# EAGLE schematic CoSchematic (EAGLE 7.5.0)
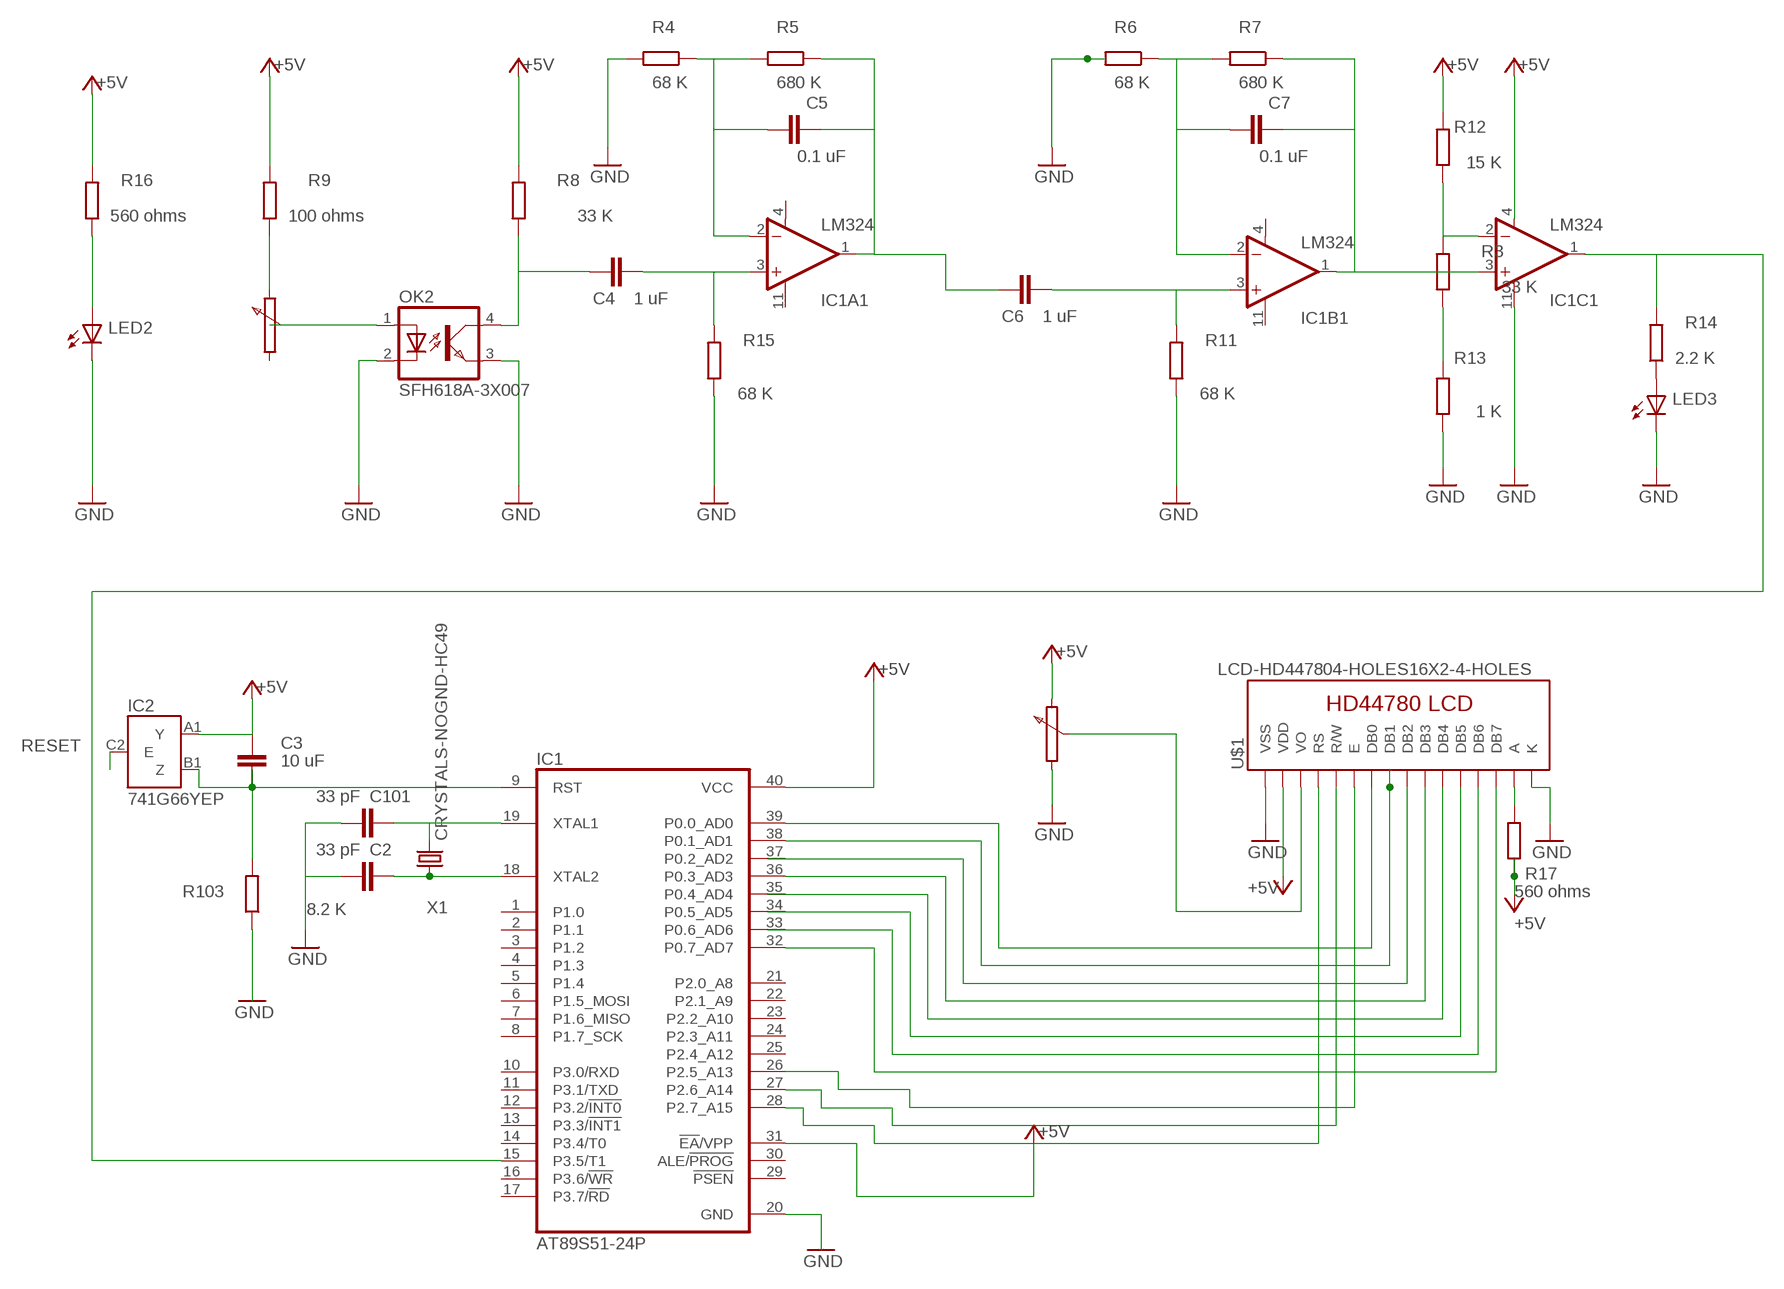
[diagram p0: schematic, sheet 1]

## Parts
C2  33 pF  C-EU050-030X075  [C050-030X075]
C3  10 uF  C-EU050-030X075  [C050-030X075]
C4  1 uF  C-EU050-030X075  [C050-030X075]
C5  0.1 uF  C-EU050-030X075  [C050-030X075]
C6  1 uF  C-EU050-030X075  [C050-030X075]
C7  0.1 uF  C-EU050-030X075  [C050-030X075]
C101  33 pF  C-EU050-030X075  [C050-030X075]
IC1  AT89S51-24P  [DIL40]
IC1A  LM324  [SOIC-14]
IC1B  LM324  [SOIC-14]
IC1C  LM324  [SOIC-14]
IC2  741G66YEP  [YEP_R-XBGA-N5]
LED2  LZ1-00WW03  [LZ1-00WW03]
LED3  LZ1-00WW03  [LZ1-00WW03]
OK2  SFH618A-3X007  [SMD4-7]
R3  33 K  R-EU_0207/10  [0207/10]
R4  68 K  R-EU_0207/10  [0207/10]
R5  680 K  R-EU_0207/10  [0207/10]
R6  68 K  R-EU_0207/10  [0207/10]
R7  680 K  R-EU_0207/10  [0207/10]
R8  33 K  R-EU_0207/10  [0207/10]
R9  100 ohms  R-EU_0207/10  [0207/10]
R11  68 K  R-EU_0207/10  [0207/10]
R12  15 K  R-EU_0207/10  [0207/10]
R13  1 K  R-EU_0207/10  [0207/10]
R14  2.2 K  R-EU_0207/10  [0207/10]
R15  68 K  R-EU_0207/10  [0207/10]
R16  560 ohms  R-EU_0207/10  [0207/10]
R17  560 ohms  R-EU_0207/10  [0207/10]
R103  8.2 K  R-EU_0207/10  [0207/10]
U$1  LCD-HD447804-HOLES16X2-4-HOLES  [LCD-16X2-4HOLES]
X1  CRYSTALS-NOGND-HC49  [HC49]

## Nets
+5V: C3.2 IC1.31(!EA!/VPP) IC1.40(VCC) R8.2 R9.2 R12.2 R16.2 R17.1 U$1.2(VDD)
GND: C2.2 C101.2 IC1C.11(1:V-) LED2.1(C) LED2.4(C) LED3.1(C) LED3.4(C) OK2.2(C) OK2.3(EMIT) R4.2 R6.2 R11.1 R13.1 R15.1 U$1.1(VSS) U$1.16(K)
N$1: C3.1 IC1.9(RST) IC2.B1(Z) R103.2
N$2: R103.1
N$4: C101.1 IC1.19(XTAL1) X1.2
N$5: U$1.3(VO)
N$6: C2.1 IC1.18(XTAL2) X1.1
N$7: IC1.28(P2.7_A15) U$1.4(RS)
N$9: R9.1
N$10: LED2.2(A) LED2.3(A) LED2.5(A) R16.1
N$11: OK2.1(A)
N$12: C4.2 IC1A.3(1:+IN) R15.2
N$13: IC1.20(GND)
N$14: C4.1 OK2.4(COL) R8.1
N$15: C5.1 IC1A.2(1:-IN) R4.1 R5.2
N$16: C5.2 C6.1 IC1A.1(1:OUT) R5.1
N$17: C7.1 IC1B.2(1:-IN) R6.1 R7.2
N$18: C6.2 IC1B.3(1:+IN) R11.2
N$19: C7.2 IC1B.1(1:OUT) IC1C.3(1:+IN) R7.1
N$20: IC1C.2(1:-IN) R3.2 R12.1
N$21: IC1.27(P2.6_A14) U$1.5(R/W)
N$22: R3.1 R13.2
N$23: IC1.26(P2.5_A13) U$1.6(E)
N$24: IC1.39(P0.0_AD0) U$1.7(DB0)
N$25: IC1.38(P0.1_AD1) U$1.8(DB1)
N$26: IC1.15(P3.5/T1) IC1C.1(1:OUT) R14.2
N$27: LED3.2(A) LED3.3(A) LED3.5(A) R14.1
N$28: U$1.9(DB2)
N$29: IC1.36(P0.3_AD3) U$1.10(DB3)
N$30: U$1.11(DB4)
N$31: U$1.12(DB5)
N$32: U$1.13(DB6)
N$33: IC1.32(P0.7_AD7) U$1.14(DB7)
N$34: R17.2 U$1.15(A)
RESET: IC2.C2(E)
Unconnected: IC1.1(P1.0) IC1.2(P1.1) IC1.3(P1.2) IC1.4(P1.3) IC1.5(P1.4) IC1.6(P1.5_MOSI) IC1.7(P1.6_MISO) IC1.8(P1.7_SCK) IC1.10(P3.0/RXD) IC1.11(P3.1/TXD) IC1.12(P3.2/!INT0) IC1.13(P3.3/!INT1) IC1.14(P3.4/T0) IC1.16(P3.6/!WR) IC1.17(P3.7/!RD) IC1.21(P2.0_A8) IC1.22(P2.1_A9) IC1.23(P2.2_A10) IC1.24(P2.3_A11) IC1.25(P2.4_A12) IC1.29(!PSEN) IC1.30(ALE/!PROG) IC1.33(P0.6_AD6) IC1.34(P0.5_AD5) IC1.35(P0.4_AD4) IC1.37(P0.2_AD2) IC1A.5(2:+IN) IC1A.6(2:-IN) IC1A.7(2:OUT) IC1A.8(3:OUT) IC1A.9(3:-IN) IC1A.10(3:+IN) IC1A.12(4:+IN) IC1A.13(4:-IN) IC1A.14(4:OUT) IC1B.5(2:+IN) IC1B.6(2:-IN) IC1B.7(2:OUT) IC1B.8(3:OUT) IC1B.9(3:-IN) IC1B.10(3:+IN) IC1B.12(4:+IN) IC1B.13(4:-IN) IC1B.14(4:OUT) IC1C.5(2:+IN) IC1C.6(2:-IN) IC1C.7(2:OUT) IC1C.8(3:OUT) IC1C.9(3:-IN) IC1C.10(3:+IN) IC1C.12(4:+IN) IC1C.13(4:-IN) IC1C.14(4:OUT) IC2.A1(Y)

## Power pins joined to a net without a drawn wire
GND: IC2.C1(GND)
V+: IC1A.4(1:V+) IC1B.4(1:V+) IC1C.4(1:V+)
V-: IC1A.11(1:V-) IC1B.11(1:V-)
VCC: IC2.A2(VCC)

## Library data of the parts
C2-C7 C101 = rcl:C-EU: CAPACITOR, European symbol
IC1 = atmel:AT89S51-*: 8-bit Microcontroller with 4K BytesIn-System Programmable Flash Source: http://www.atmel.com/dyn/resources/prod_documents/doc2487.pdf; MPN: AT89S51-24PU; OC_FARNELL: 1095739; OC_NEWARK: 96K6578
IC1A IC1B IC1C = seanvoisen:LM324: LM324 Quad Op-amp
IC2 = 74xx-little-us:74*1G66: Single Analog / Bilateral Switch Source: http://www.semiconductors.philips.com/acrobat_download/datasheets/74HC_HCT1G66_3.pdf
LED2 LED3 = led:LZ1-00WW03: High Luminous Efficacy 3W Warm White LED Emitter Source: http://www.ledengin.com/products/3wLZ/LZ1-00WW03.pdf
OK2 = optocoupler:SFH618?*: Optocoupler, Phototransistor Output, Low Input Current Source: Data sheet <http://www.vishay.com/docs/83673/sfh618.pdf>; OC_FARNELL: unknown; OC_NEWARK: unknown
R3-R9 R11-R17 R103 = rcl:R-EU_: RESISTOR, European symbol
U$1 = HD44780LCD:LCD-HD44780
X1 = IQD-Frequency-Products:CRYSTALS-NOGND: CRYSTALS CAN NOT GROUNDED